# EAGLE design thermometer (EAGLE 7.7.0)
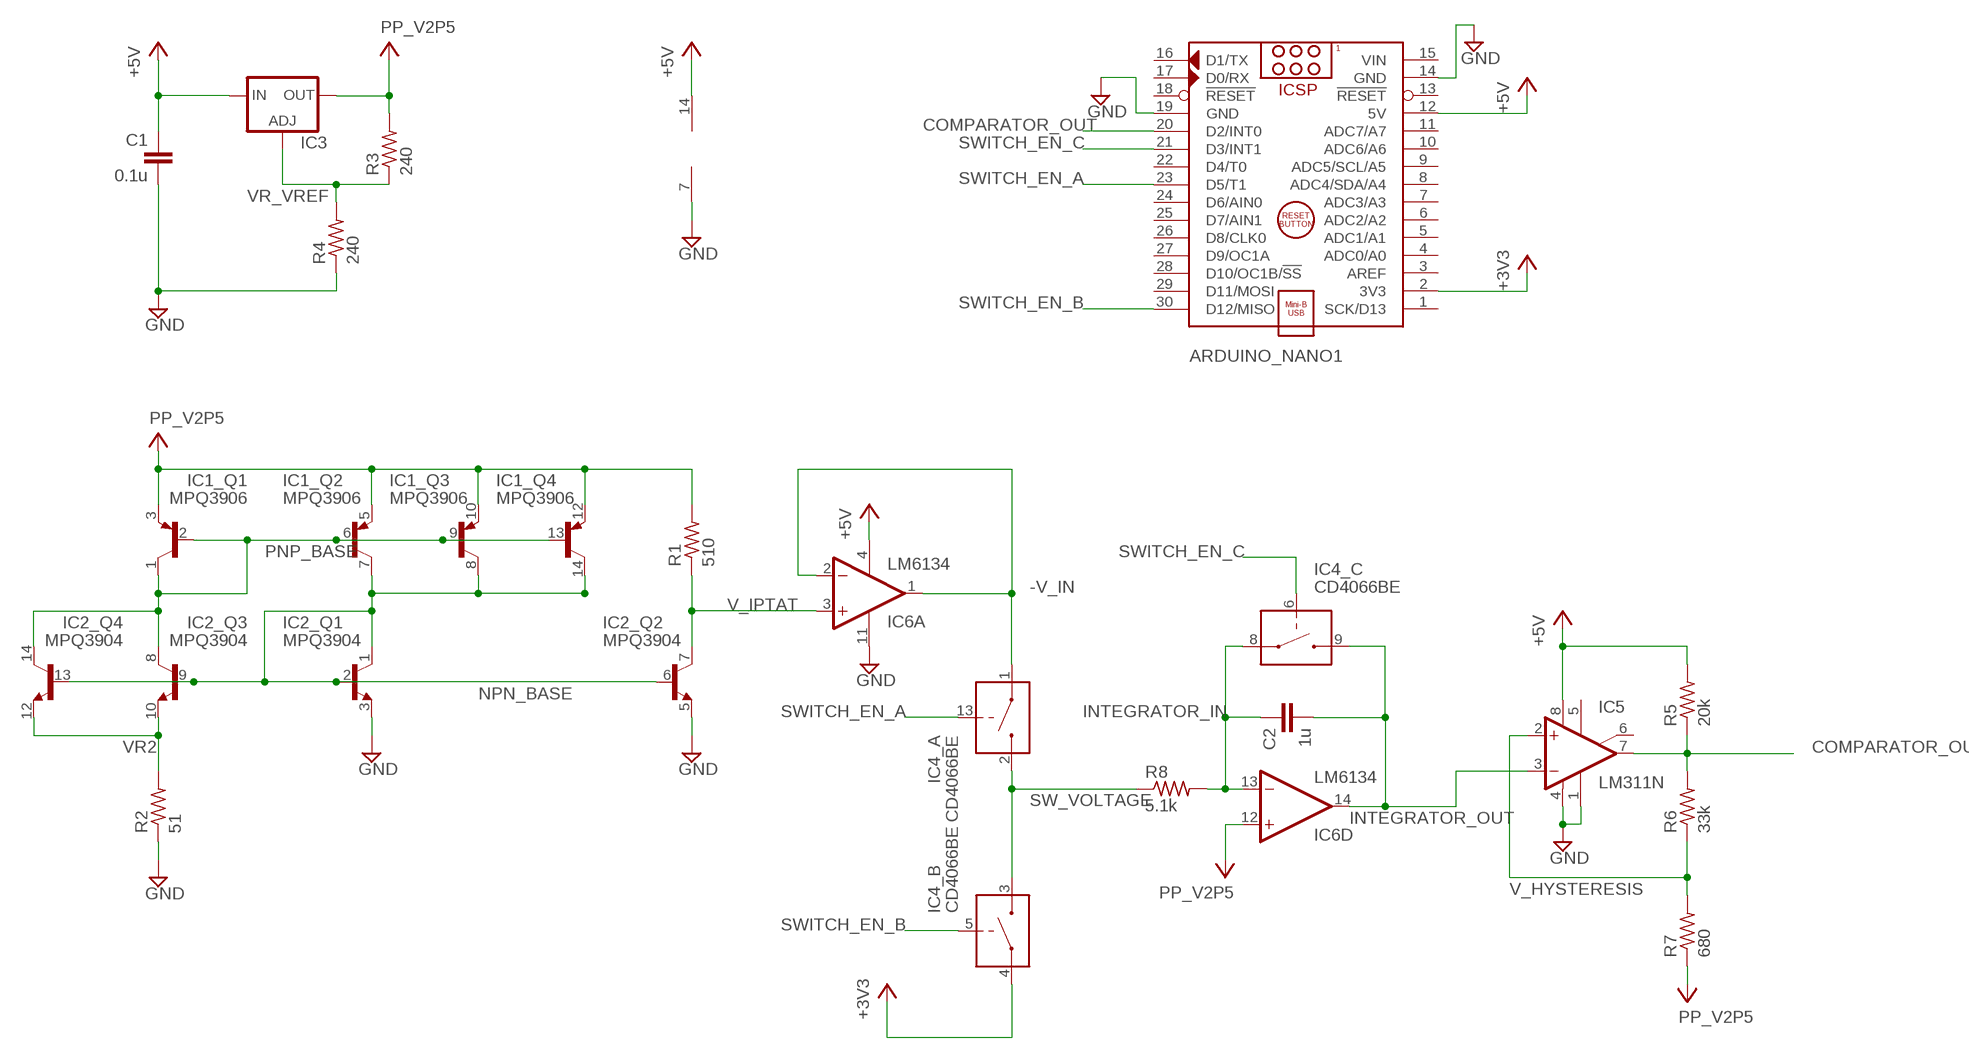
[diagram p0: schematic, sheet 1]

## Parts
ARDUINO_NANO1  ARDUINO_NANO  [ARDUINO_NANO]
C1  0.1u  C-EU050-035X075  [C050-035X075]
C2  1u  C-EU050-035X075  [C050-035X075]
IC1  MPQ3906  [DIL14]
IC2  MPQ3904  [DIL14]
IC3  LM317TS  [317TS]
IC4  CD4066BE  [DIL14]
IC5  LM311N  [DIL08]
IC6  LM6134  LM324N  [DIL14]
R1  510  R-US_0207/10  [0207/10]
R2  51  R-US_0207/10  [0207/10]
R3  240  R-US_0207/10  [0207/10]
R4  240  R-US_0207/10  [0207/10]
R5  20k  R-US_0207/10  [0207/10]
R6  33k  R-US_0207/10  [0207/10]
R7  680  R-US_0207/10  [0207/10]
R8  5.1k  R-US_0207/10  [0207/10]

## Nets
+3V3: ARDUINO_NANO1.2(3V3) IC4.4(_B:IN/OUT1)
+5V: ARDUINO_NANO1.12(5V) C1.1 IC3.3(IN) IC4.14(V+) IC5.8(V+) IC6.4(P:V+) R5.2
-V_IN: IC4.1(_A:IN/OUT1) IC6.1(A:OUT) IC6.2(A:-IN)
COMPARATOR_OUT: ARDUINO_NANO1.20(D2/INT0) IC5.7(OUT) R5.1 R6.2
GND: ARDUINO_NANO1.14(GND) ARDUINO_NANO1.19(GND) C1.2 IC2.3(_Q1:E) IC2.5(_Q2:E) IC4.7(V-) IC5.1(GND) IC5.4(V-) IC6.11(P:V-) R2.1 R4.1
INTEGRATOR_IN: C2.1 IC4.8(_C:IN/OUT1) IC6.13(D:-IN) R8.2
INTEGRATOR_OUT: C2.2 IC4.9(_C:IN/OUT2) IC5.3(-IN) IC6.14(D:OUT)
NPN_BASE: IC1.7(_Q2:C) IC1.8(_Q3:C) IC1.14(_Q4:C) IC2.1(_Q1:C) IC2.2(_Q1:B) IC2.6(_Q2:B) IC2.9(_Q3:B) IC2.13(_Q4:B)
PNP_BASE: IC1.1(_Q1:C) IC1.2(_Q1:B) IC1.6(_Q2:B) IC1.9(_Q3:B) IC1.13(_Q4:B) IC2.8(_Q3:C) IC2.14(_Q4:C)
SW_VOLTAGE: IC4.2(_A:IN/OUT2) IC4.3(_B:IN/OUT2) R8.1
SWITCH_EN_A: ARDUINO_NANO1.23(D5/T1) IC4.13(_A:CONTROL)
SWITCH_EN_B: ARDUINO_NANO1.30(D12/MISO) IC4.5(_B:CONTROL)
SWITCH_EN_C: ARDUINO_NANO1.21(D3/INT1) IC4.6(_C:CONTROL)
V+: IC1.3(_Q1:E) IC1.5(_Q2:E) IC1.10(_Q3:E) IC1.12(_Q4:E) IC3.2(OUT) IC6.12(D:+IN) R1.2 R3.2 R7.1 ; supply symbol labelled PP_V2P5
V_HYSTERESIS: IC5.2(+IN) R6.1 R7.2
V_IPTAT: IC2.7(_Q2:C) IC6.3(A:+IN) R1.1
VR2: IC2.10(_Q3:E) IC2.12(_Q4:E) R2.2
VR_VREF: IC3.1(ADJ) R3.1 R4.2
Unconnected: ARDUINO_NANO1.1(SCK/D13) ARDUINO_NANO1.3(AREF) ARDUINO_NANO1.4(ADC0/A0) ARDUINO_NANO1.5(ADC1/A1) ARDUINO_NANO1.6(ADC2/A2) ARDUINO_NANO1.7(ADC3/A3) ARDUINO_NANO1.8(ADC4/SDA/A4) ARDUINO_NANO1.9(ADC5/SCL/A5) ARDUINO_NANO1.10(ADC6/A6) ARDUINO_NANO1.11(ADC7/A7) ARDUINO_NANO1.13(!RESET) ARDUINO_NANO1.16(D1/TX) ARDUINO_NANO1.17(D0/RX) ARDUINO_NANO1.18(!RESET) ARDUINO_NANO1.22(D4/T0) ARDUINO_NANO1.24(D6/AIN0) ARDUINO_NANO1.25(D7/AIN1) ARDUINO_NANO1.26(D8/CLK0) ARDUINO_NANO1.27(D9/OC1A) ARDUINO_NANO1.28(D10/OC1B/!SS) ARDUINO_NANO1.29(D11/MOSI) IC4.10(_D:IN/OUT2) IC4.11(_D:IN/OUT1) IC4.12(_D:CONTROL) IC5.5(ON) IC5.6(ON/STR) IC6.5(B:+IN) IC6.6(B:-IN) IC6.7(B:OUT) IC6.8(C:OUT) IC6.9(C:-IN) IC6.10(C:+IN)

## Power pins joined to a net without a drawn wire
VIN: ARDUINO_NANO1.15(VIN)

## Library data of the parts
ARDUINO_NANO1 = 6301-temp-sensor-rev1:ARDUINO_NANO: Arduino Nano V3.0 Module Overview: The Arduino Nano is a small, complete, and breadboard-friendly board based on the ATmega328 (Arduino Nano 3.x) or ATmega168 (Arduino Nano 2.x). It has more or less the same functionality of the Arduino Duemilanove, but in a different package. It lacks only a DC power jack, and works with a Mini-B USB cable instead of a standard one. The Nano was designed and is being produced by Gravitech <http://www.gravitech.us/arna30wiatp.html>. General specifications: Item Value Microcontroller Atmel ATmega168 or ATmega328 Operating Voltage (logic level) 5 V Input Voltage (recommended) 7-12 V Input Voltage (limits) 6-20 V Digital I/O Pins 14 (of which 6 provide PWM output) Analog Input Pins 8 DC Current per I/O Pin 40 mA Flash Memory 16 KB (ATmega168) or 32 KB (ATmega328) of which 2 KB used by bootloader SRAM 1 KB (ATmega168) or 2 KB (ATmega328) EEPROM 512 bytes (ATmega168) or 1 KB (ATmega328) Clock Speed 16 MHz Dimensions (Inches) 0.73" x 1.70" Dimensions (mm) 18mm x 45mm Overall height About 9 mm (not including pins) Weigth 5 g Power: The Arduino Nano can be powered via the Mini-B USB connection, 6-20V unregulated external power supply (pin 30), or 5V regulated external power supply (pin 27). The power source is automatically selected to the highest voltage source. Memory: The ATmega168 has 16 KB of flash memory for storing code (of which 2 KB is used for the bootloader); the ATmega328 has 32 KB, (also with 2 KB used for the bootloader). The ATmega168 has 1 KB of SRAM and 512 bytes of EEPROM (which can be read and written with the EEPROM library); the ATmega328 has 2 KB of SRAM and 1 KB of EEPROM. Input and Output: Each of the 14 digital pins on the Nano can be used as an input or output, using pinMode(), digitalWrite(), and digitalRead() functions. They operate at 5 volts. Each pin can provide or receive a maximum of 40 mA and has an internal pull-up resistor (disconnected by default) of 20-50 kOhms. In addition, some pins have specialized functions. Visit Arduino - ArduinoBoardNano <https://www.arduino.cc/en/Main/ArduinoBoardNano>
C1 C2 = rcl:C-EU: CAPACITOR, European symbol
IC1 = 6301-temp-sensor-rev1:MPQ3906
IC2 = 6301-temp-sensor-rev1:MPQ3904
IC3 = v-reg:LM317TS: VOLTAGE REGULATOR
IC4 = 6301-temp-sensor-rev1:CD4066BE
IC5 = 6301-temp-sensor-rev1:LM311: COMPARATOR
IC6 = linear:LM324: OP AMP
R1-R8 = rcl:R-US_: RESISTOR, American symbol

## Board
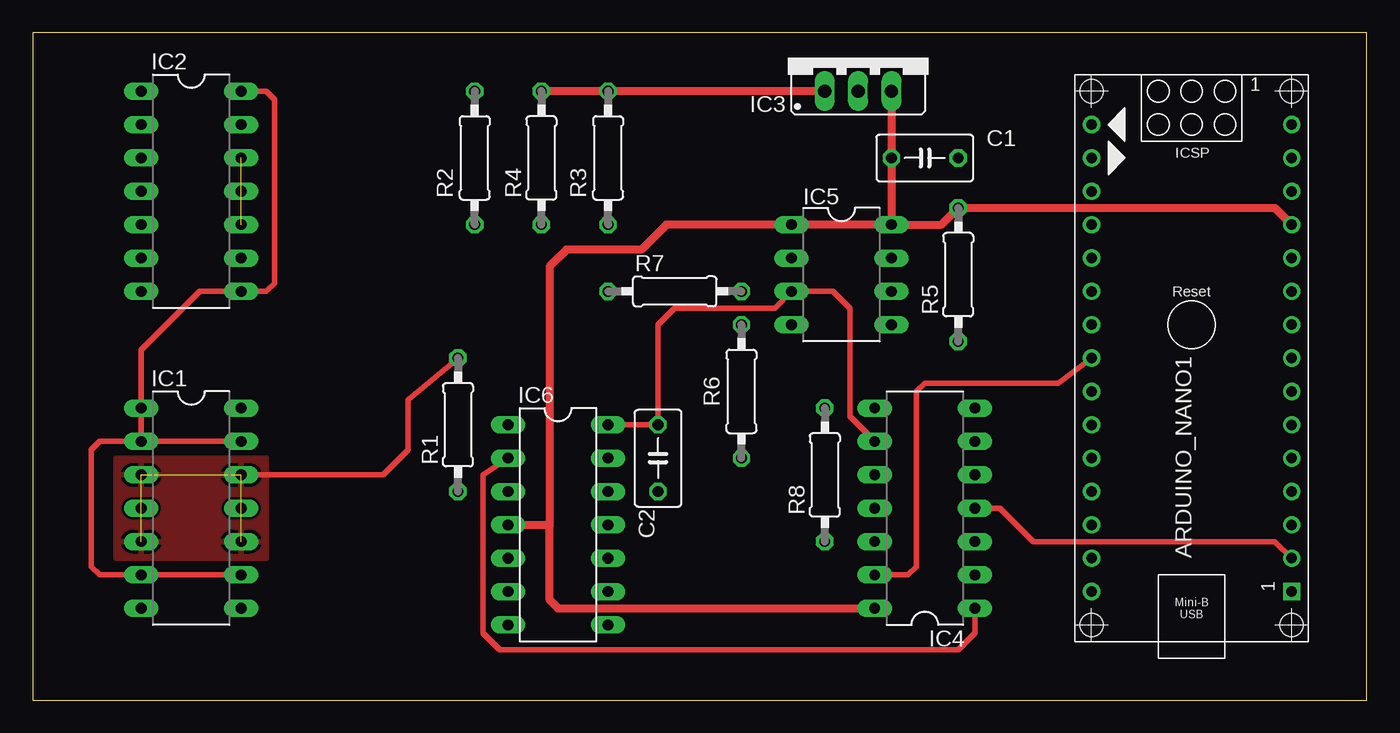
[diagram p1: board, top side]
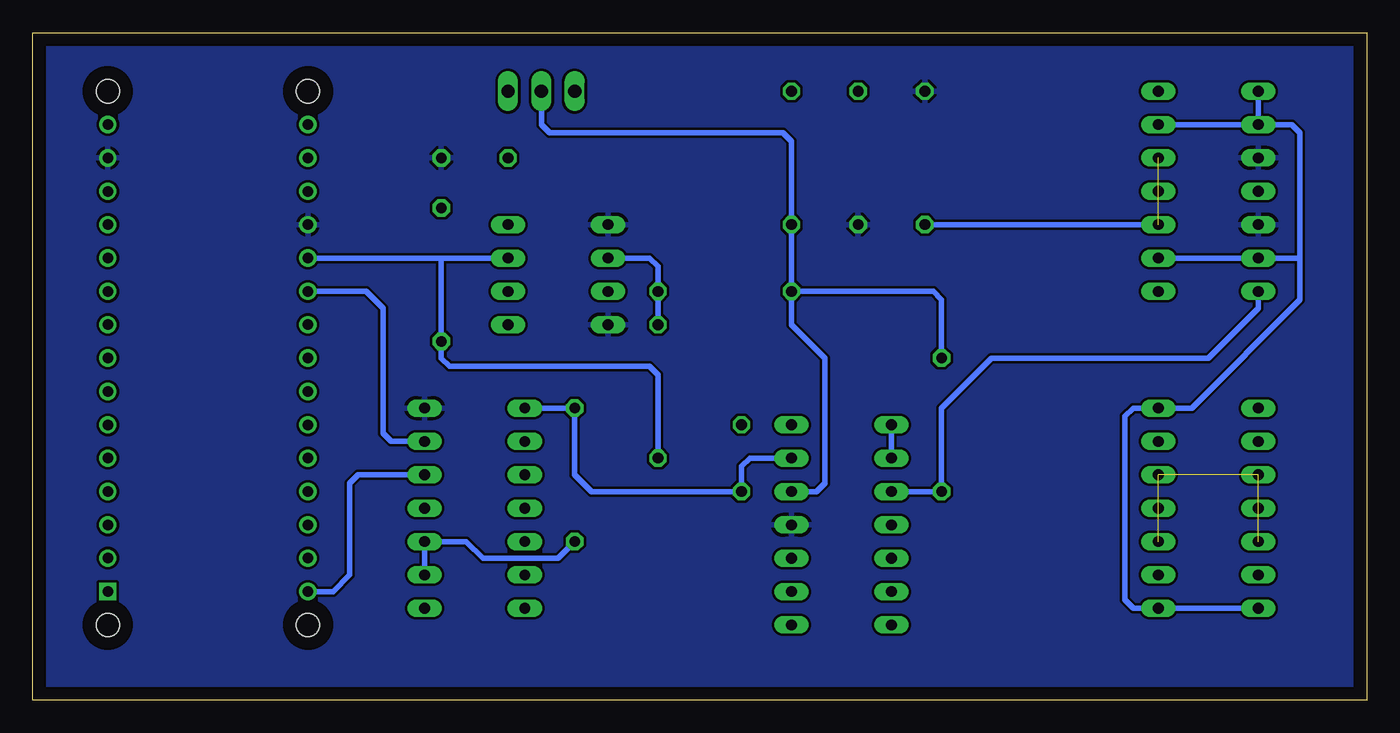
[diagram p2: board, bottom side, seen from below]

Size 101.6 x 50.8 mm. Coordinates in mm from the lower left corner, seen from the top.
Outline: 0,0 101.6,0 101.6,50.8 0,50.8 0,0
Copper layers (1*16): Top 0.035mm / dielectric 1.5mm / Bottom 0.035mm
Design rules "default": minimum track width 10mil, minimum drill 24mil, track to track 8mil, track to pad 8mil, pad to pad 8mil, via to via 8mil, smd to smd 8mil, copper to edge 40mil, drill to drill 8mil, minimum pad ring 10mil, minimum via ring 8mil, stop-mask expansion 4mil, vias tented up to drill 0mil, thermal gap 10mil

### Footprints (pad centres in the part's own frame; a part is rotated, then mirrored left to right if it is on the bottom)
ARDUINO_NANO = drill 0.8 square: 1 -20.32,-7.62 | drill 0.8: 2 -17.78,-7.62; 3 -15.24,-7.62; 4 -12.7,-7.62; 5 -10.16,-7.62; 6 -7.62,-7.62; 7 -5.08,-7.62; 8 -2.54,-7.62; 9 0,-7.62; 10 2.54,-7.62; 11 5.08,-7.62; 12 7.62,-7.62; 13 10.16,-7.62; 14 12.7,-7.62; 15 15.24,-7.62; 16 15.24,7.62; 17 12.7,7.62; 18 10.16,7.62; 19 7.62,7.62; 20 5.08,7.62; 21 2.54,7.62; 22 0,7.62; 23 -2.54,7.62; 24 -5.08,7.62; 25 -7.62,7.62; 26 -10.16,7.62; 27 -12.7,7.62; 28 -15.24,7.62; 29 -17.78,7.62; 30 -20.32,7.62 | hole 1.778: -22.86,-7.62; -22.86,7.62; 17.78,7.62; 17.78,-7.62
C050-035X075 = drill 0.813 octagon: 1 -2.54,0; 2 2.54,0
DIL14 = drill 0.813 long: 1 -7.62,-3.81; 2 -5.08,-3.81; 3 -2.54,-3.81; 4 0,-3.81; 5 2.54,-3.81; 6 5.08,-3.81; 7 7.62,-3.81; 8 7.62,3.81; 9 5.08,3.81; 10 2.54,3.81; 11 0,3.81; 12 -2.54,3.81; 13 -5.08,3.81; 14 -7.62,3.81
317TS = drill 1.016 long: 1 -2.54,-2.54; 2 0,-2.54; 3 2.54,-2.54
DIL08 = drill 0.813 long: 1 -3.81,-3.81; 2 -1.27,-3.81; 3 1.27,-3.81; 4 3.81,-3.81; 5 3.81,3.81; 6 1.27,3.81; 7 -1.27,3.81; 8 -3.81,3.81
0207/10 = drill 0.813 octagon: 1 -5.08,0; 2 5.08,0

### Placement (x,y rotation side)
ARDUINO_NANO1  88.27,28.57 90 top
C1  67.94,41.27 0 top
C2  47.62,18.41 90 top
IC1  12.06,14.61 270 top
IC2  12.06,38.73 270 top
IC3  62.87,48.9 0 top
IC4  67.94,14.61 90 top
IC5  61.59,32.38 270 top
IC6  40.01,13.34 270 top
R1  32.38,20.95 90 top
R2  33.66,41.27 270 top
R3  43.81,41.27 270 top
R4  38.73,41.27 90 top
R5  70.48,32.38 90 top
R6  53.98,23.5 270 top
R7  48.9,31.11 0 top
R8  60.33,17.14 90 top

### Tracks (layer width: path | path; a pad name or v marks a point on that pad's centre or on a via)
+3V3
  Top 0.406: ARDUINO_NANO1.2 94.61,12.06 76.2,12.06 73.66,14.61 IC4.4
+5V
  Top 0.61: IC3.3 C1.1 IC5.8 | IC5.8 69.22,36.2 R5.2 94.61,37.47 ARDUINO_NANO1.12 | IC6.4 39.37,13.34 | IC4.14 40.01,6.99 39.37,7.62 39.37,13.34 | IC5.8 48.26,36.2 46.35,34.29 40.64,34.29 39.37,33.02 39.37,13.34
-V_IN
  Top 0.406: IC6.2 34.29,17.14 34.29,5.08 35.56,3.81 70.48,3.81 71.75,5.08 IC4.1
  Bottom 0.406: IC6.2 IC6.1
COMPARATOR_OUT
  Bottom 0.406: 70.48,33.66 R5.1 70.48,26.04 69.85,25.4 54.61,25.4 53.98,24.77 R6.2 | 70.48,33.66 ARDUINO_NANO1.20 | IC5.7 70.48,33.66
GND
  pour Bottom: 0,50.8 101.6,50.8 101.6,0 0,0
INTEGRATOR_IN
  Bottom 0.406: IC4.8 R8.2 60.33,17.14 59.05,15.88 C2.1 47.62,17.78 46.99,18.41 IC6.13
INTEGRATOR_OUT
  Top 0.406: IC4.9 62.23,21.59 62.23,29.84 60.96,31.11 IC5.3 56.52,29.84 48.9,29.84 47.62,28.57 C2.2 IC6.14
NPN_BASE
  Bottom 0.406: IC2.1 IC2.2 | IC2.2 IC2.13 | IC1.7 IC1.8 17.78,6.99 18.41,7.62 18.41,21.59 17.78,22.23 IC1.14 13.34,22.23 5.08,30.48 5.08,33.66 | 5.08,33.66 IC2.6 IC2.9 | 5.08,33.66 5.08,43.18 5.71,43.81 IC2.2
PNP_BASE
  Top 0.406: IC1.2 IC1.1 8.26,26.67 12.7,31.11 IC2.8 17.78,31.11 18.41,31.75 18.41,45.72 17.78,46.35 IC2.14 | IC1.2 IC1.13 | IC1.2 5.08,19.68 4.45,19.05 4.45,10.16 5.08,9.53 IC1.6 IC1.9
SW_VOLTAGE
  Bottom 0.406: IC4.2 IC4.3 68.58,12.06 67.31,10.79 61.59,10.79 R8.1
SWITCH_EN_A
  Top 0.406: IC4.13 66.67,9.53 67.31,10.16 67.31,23.5 67.94,24.13 78.11,24.13 ARDUINO_NANO1.23
SWITCH_EN_B
  Bottom 0.406: IC4.5 76.83,17.14 77.47,16.51 77.47,9.53 78.74,8.26 ARDUINO_NANO1.30
SWITCH_EN_C
  Bottom 0.406: IC4.6 74.3,19.68 74.93,20.32 74.93,29.84 76.2,31.11 ARDUINO_NANO1.21
V+  (3 unrouted)
  Top 0.406: R1.2 28.57,22.86 28.57,19.05 26.67,17.14 IC1.12
  Bottom 0.406: R7.1 R3.2 43.81,42.55 44.45,43.18 62.23,43.18 62.87,43.81 IC3.2 | R1.2 32.38,30.48 33.02,31.11 R7.1 | R7.1 43.81,28.57 41.27,26.04 41.27,16.51 41.91,15.88 IC6.12
  pour Top: 6.35,18.41 6.35,10.79 17.78,10.79 17.78,18.41
V_HYSTERESIS
  Bottom 0.406: R6.1 R7.2 53.98,33.02 54.61,33.66 IC5.2
V_IPTAT
  Bottom 0.406: IC6.3 R1.1 32.38,22.23 28.57,26.04 12.06,26.04 8.26,29.84 IC2.7
VR2  (1 unrouted)
  Bottom 0.406: R2.2 IC2.10
VR_VREF
  Top 0.61: IC3.1 R3.1 R4.2